# EAGLE design Arduinoboy (EAGLE 7.6.0)
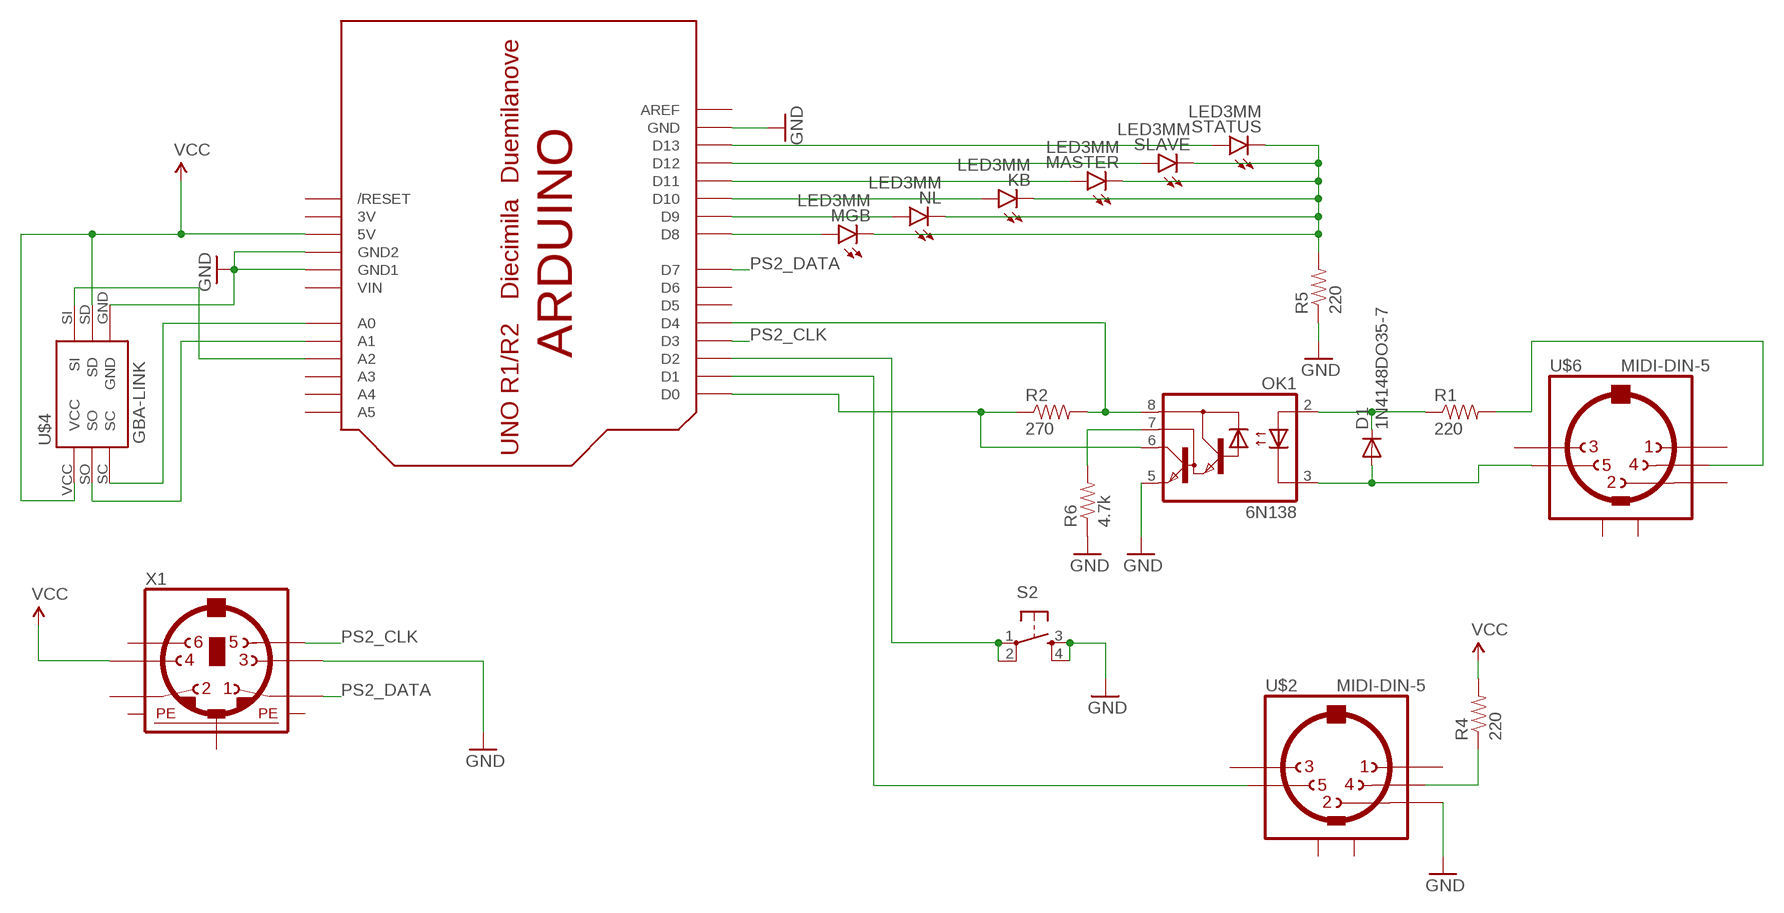
[diagram p0: schematic, sheet 1]

## Parts
D1  1N4148DO35-7  [DO35-7]
KB  LED3MM  [LED3MM]
MASTER  LED3MM  [LED3MM]
MGB  LED3MM  [LED3MM]
NL  LED3MM  [LED3MM]
OK1  6N138  [DIL08]
R1  220  RESISTORAXIAL-0.3  [AXIAL-0.3]
R2  270  RESISTORAXIAL-0.3  [AXIAL-0.3]
R4  220  RESISTORAXIAL-0.3  [AXIAL-0.3]
R5  220  RESISTORAXIAL-0.3  [AXIAL-0.3]
R6  4.7k  RESISTORAXIAL-0.3  [AXIAL-0.3]
S2  TAC_SWITCHPTH  [TACTILE-PTH]
SLAVE  LED3MM  [LED3MM]
STATUS  LED3MM  [LED3MM]
U$2  MIDI-DIN-5  [MIDI-DIN-5]
U$3  ARDUINOUNO  [ARDUINO]
U$4  GBA-LINK  [GBA-LINK]
U$6  MIDI-DIN-5  [MIDI-DIN-5]
X1  MINI_DIN_6  [M_DIN6]

## Nets
GND: OK1.5(GND) R5.P$1 R6.P$1 S2.3 S2.4 U$2.2 U$3.GND U$3.GND1 U$3.GND2 U$4.GND X1.3
N$1: D1.C OK1.2(A) R1.P$1
N$2: D1.A OK1.3(C) U$6.5
N$5: R4.P$1 U$2.4
N$6: MGB.A U$3.D8
N$7: U$2.5 U$3.D1
N$8: NL.A U$3.D9
N$9: OK1.8(VCC) R2.P$2 U$3.D4
N$10: OK1.6(VO) R2.P$1 U$3.D0
N$11: KB.A U$3.D10
N$12: MASTER.A U$3.D11
N$13: SLAVE.A U$3.D12
N$14: STATUS.A U$3.D13
N$15: KB.K(C) MASTER.K(C) MGB.K(C) NL.K(C) R5.P$2 SLAVE.K(C) STATUS.K(C)
N$16: OK1.7(VB) R6.P$2
N$17: U$3.A0 U$4.SC
N$19: R1.P$2 U$6.4
N$20: S2.1 S2.2 U$3.D2
N$21: U$3.A1 U$4.SO
N$22: U$3.A2 U$4.SI
PS2_CLK: U$3.D3 X1.5
PS2_DATA: U$3.D7 X1.1
VCC: R4.P$2 U$3.5V U$4.SD U$4.VCC X1.4
Unconnected: U$2.1 U$2.3 U$2.PE1 U$2.PE2 U$2.PE11(PE1) U$2.PE22(PE2) U$3.A3 U$3.A4 U$3.A5 U$3.AREF U$3.D5 U$3.D6 U$3.RESET(/RESET) U$4.S$1 U$4.S$2(S$1) U$6.1 U$6.2 U$6.3 U$6.PE1 U$6.PE2 U$6.PE11(PE1) U$6.PE22(PE2) X1.2 X1.6

## Power pins joined to a net without a drawn wire
3V: U$3.3V
PE1: X1.SH1(PE1)
PE2: X1.SH2(PE2)
PE3: X1.SH3(PE3)
VIN: U$3.VIN

## Library data of the parts
D1 = diode:1N4148: DIODE high speed (Philips)
KB MASTER MGB NL SLAVE STATUS = gm-diodes:LED
OK1 = optocoupler:6N138: MOTOROLA OPTO COUPLER
R1 R2 R4-R6 = SparkFun-Resistors:RESISTOR: Resistor Basic schematic elements and footprints for 0603, 1206, and PTH resistors.
S2 = SparkFun-Retired:TAC_SWITCH: Momentary Switch Button commonly used for reset or general input. Spark Fun Electronics SKU : COM-00097 SMT- SWCH-08247
U$2 U$6 = MIDI by Jazz:MIDI-DIN-5
U$3 = adafruit_modif:ARDUINO: Arduino Diecimila/Duemilanove Make a shield with ease, this package has all the named pins as well as the two mounting drill holes and an outline of the USB and DC power connector. The outline is on the DIMENSION layer, so if your board house uses it they will cut the outline to match. http://www.ladyada.net/library/pcb/eaglelibrary.html
U$4 = Catskulls_link_port:GBA-LINK
X1 = mini_din:MINI_DIN_6

## Board
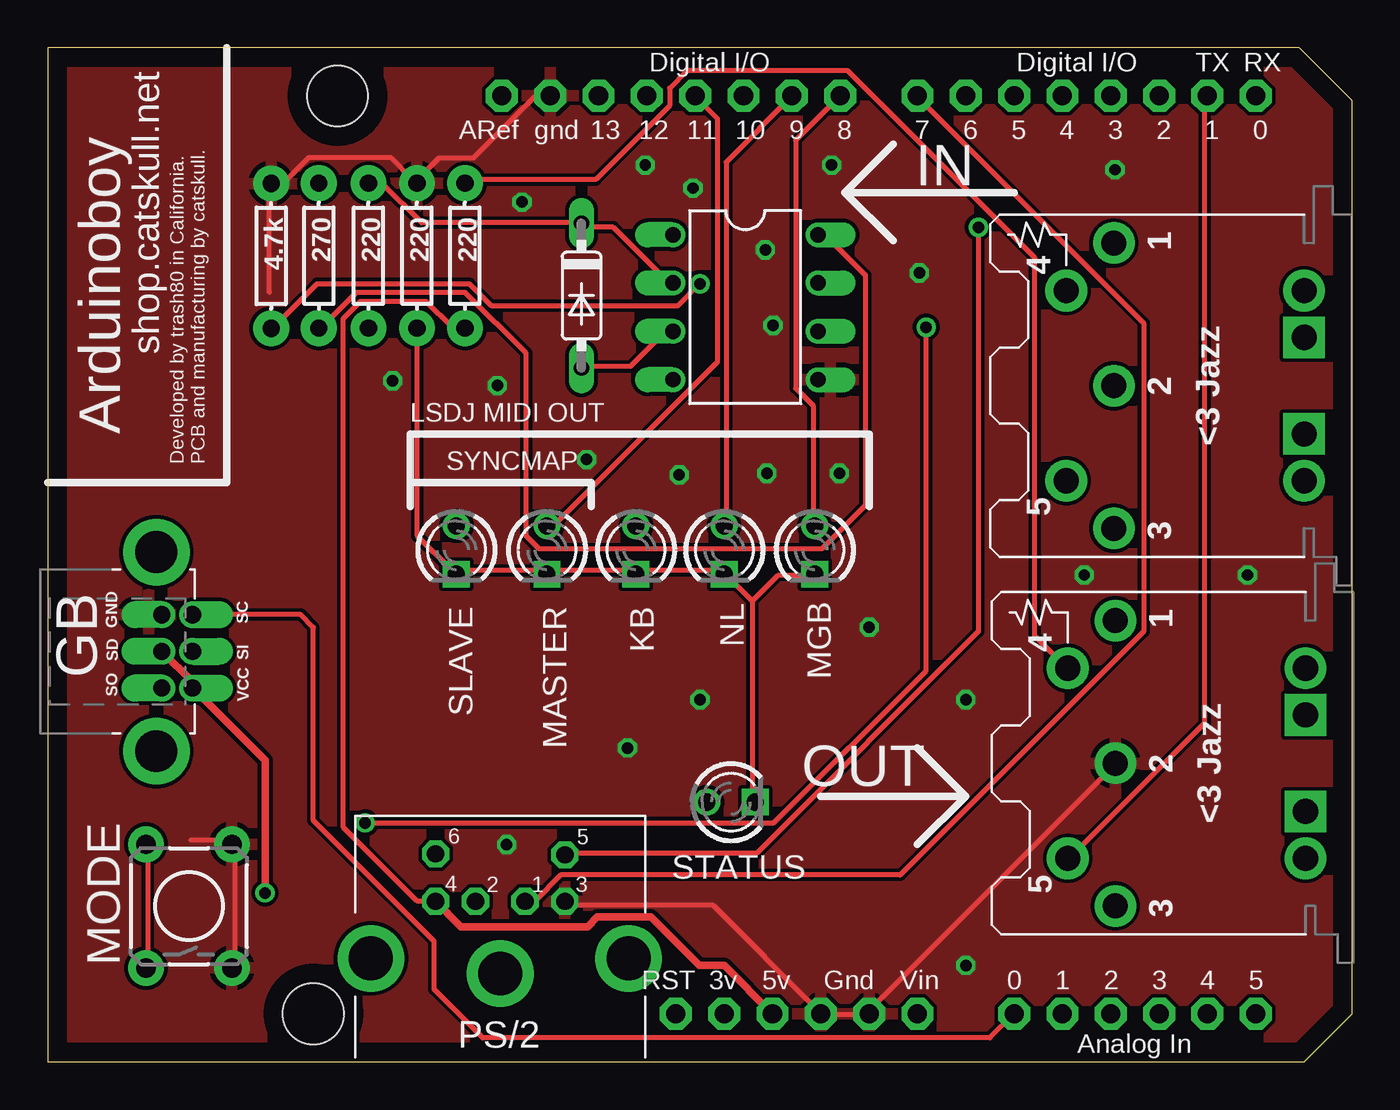
[diagram p1: board, top side]
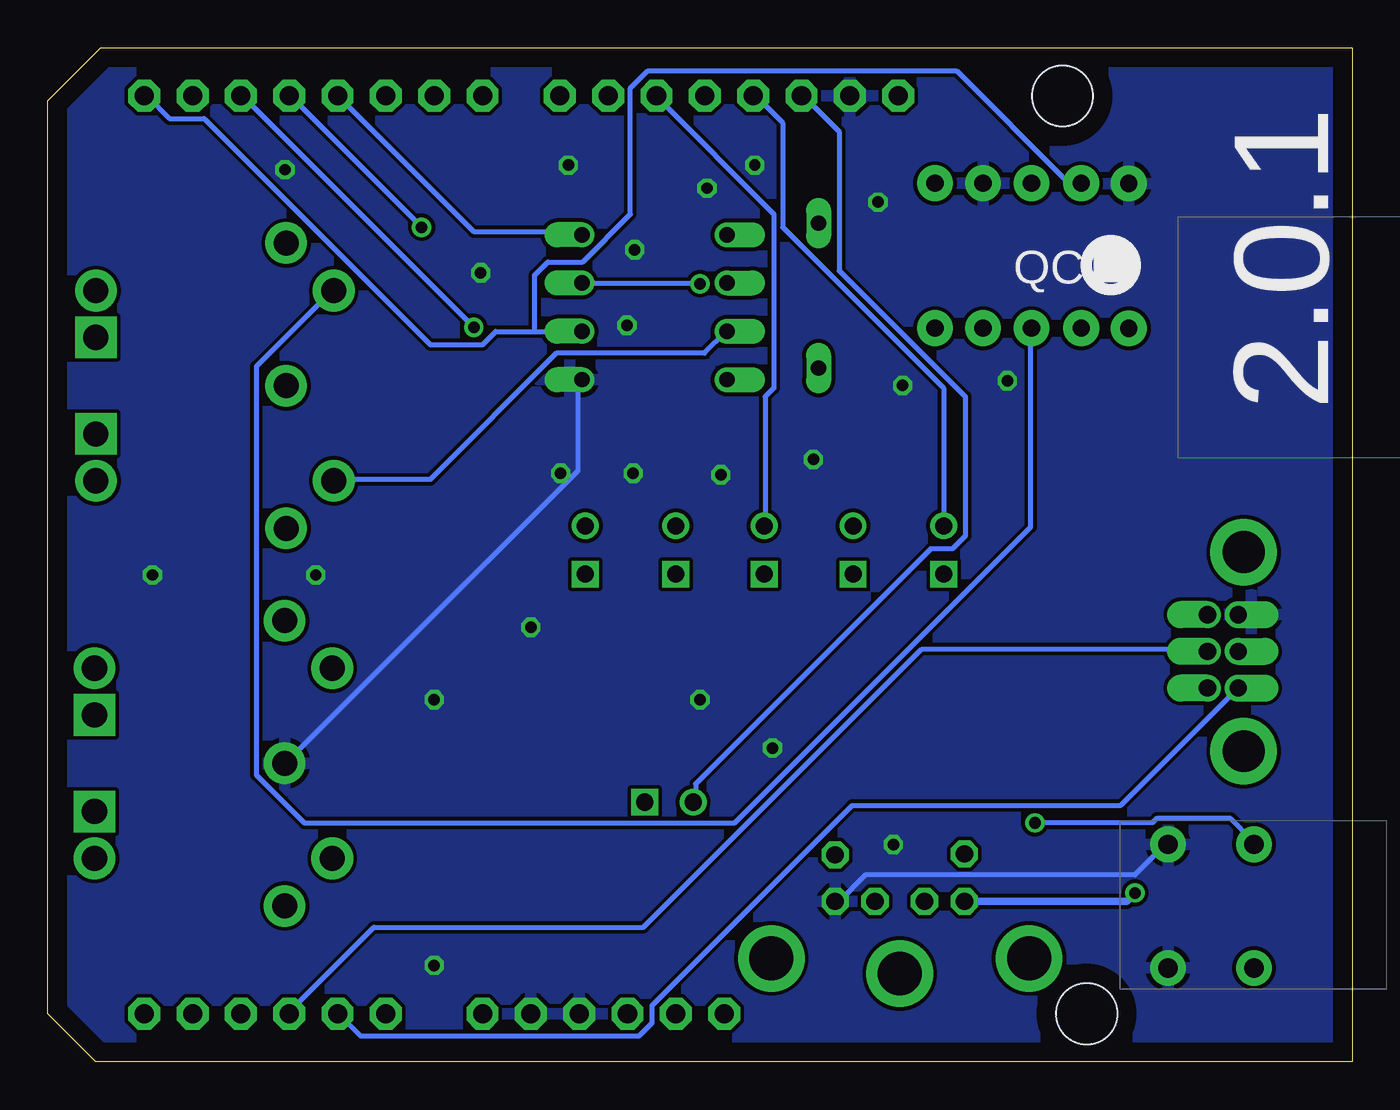
[diagram p2: board, bottom side, seen from below]

Size 68.58 x 53.34 mm. Coordinates in mm from the lower left corner, seen from the top.
Copper layers (1*16): Top 0.035mm / dielectric 1.5mm / Bottom 0.035mm
Design rules "default *": minimum track width 10mil, minimum drill 24mil, track to track 8mil, track to pad 8mil, pad to pad 8mil, via to via 8mil, smd to smd 8mil, copper to edge 40mil, drill to drill 8mil, minimum pad ring 10mil, minimum via ring 8mil, stop-mask expansion 4mil, vias tented up to drill 25mil, thermal gap 10mil

### Footprints (pad centres in the part's own frame; a part is rotated, then mirrored left to right if it is on the bottom)
DO35-7 = drill 0.813 long: A 3.81,0; C -3.81,0
LED3MM = drill 0.9: A -1.27,0 | drill 0.9 square: K 1.27,0
DIL08 = drill 0.813 offset: 1 -3.81,-3.81; 2 -1.27,-3.81; 3 1.27,-3.81; 4 3.81,-3.81; 5 3.81,3.81; 6 1.27,3.81; 7 -1.27,3.81; 8 -3.81,3.81
AXIAL-0.3 = drill 0.9 pad 1.88: P$1 -3.81,0; P$2 3.81,0
TACTILE-PTH = drill 1.016 pad 1.88: 1 -3.251,2.261; 2 3.251,2.261; 3 -3.251,-2.261; 4 3.251,-2.261
MIDI-DIN-5 = drill 1.321 pad 2.184: 1 -7.5,-10; 2 0,-10; 3 7.5,-10; 4 -5,-12.5; 5 5,-12.5; PE1 5,0; PE2 -5,0 | drill 1.321 pad 2.184 square: PE11 2.54,0; PE22 -2.54,0
ARDUINO = drill 1 pad 1.676 octagon: 3V 35.56,2.54; 5V 38.1,2.54; A0 50.8,2.54; A1 53.34,2.54; A2 55.88,2.54; A3 58.42,2.54; A4 60.96,2.54; A5 63.5,2.54; AREF 23.876,50.8; D0 63.5,50.8; D1 60.96,50.8; D2 58.42,50.8; D3 55.88,50.8; D4 53.34,50.8; D5 50.8,50.8; D6 48.26,50.8; D7 45.72,50.8; D8 41.656,50.8; D9 39.116,50.8; D10 36.576,50.8; D11 34.036,50.8; D12 31.496,50.8; D13 28.956,50.8; GND 26.416,50.8; GND1 43.18,2.54; GND2 40.64,2.54; RESET 33.02,2.54; VIN 45.72,2.54 | hole 3.2: 15.24,50.8; 13.97,2.54
GBA-LINK = drill 0.9 pad 1.27 offset: GND -1.93,-1.61; SC -1.93,0; SD 0,-1.61; SI 0,0; SO 1.93,-1.61; VCC 1.93,0 | drill 2.2 pad 3.5: S$1 -5.22,-1.905; S$2 5.25,-1.905
M_DIN6 = drill 0.9 pad 1.422 octagon: 1 -1.3,-3.75; 2 1.3,-3.75; 3 -3.4,-3.75; 4 3.4,-3.75; 5 -3.4,-6.2; 6 3.4,-6.25 | drill 2.3 pad 3.5: SH1 6.8,-0.75; SH2 0,0.05; SH3 -6.75,-0.75

### Placement (x,y rotation side)
D1  28.06,40.3 270 top
KB  30.92,26.92 270 top
MASTER  26.24,26.92 270 top
MGB  40.32,26.92 270 top
NL  35.56,26.92 270 top
OK1  36.67,39.69 270 top
R1  16.87,42.39 270 top
R2  14.25,42.39 270 top
R4  21.94,42.39 270 top
R5  19.41,42.39 270 top
R6  11.75,42.38 270 top
S2  7.43,8.19 90 top
SLAVE  21.48,26.92 270 top
STATUS  35.92,13.67 0 top
U$2  66.12,15.71 270 top
U$3  0,0 0 top
U$4  7.62,21.59 270 top
U$6  66.04,35.56 270 top
X1  23.79,4.7 180 top

### Tracks (layer width: path | path; a pad name or v marks a point on that pad's centre or on a via)
GND  (via drill 0.6)
  Top 0.254: X1.3 27.2,8.23 34.98,8.23 40.46,2.74 U$3.GND2 40.69,2.52 42.98,2.52 U$3.GND1 43.2,2.74 56.01,15.54 U$2.2 | U$3.GND 26.29,50.75 25.6,50.75 22.4,47.55 20.57,47.55 19.43,46.41 R5.P$1 19.2,46.41 18.06,47.55 13.72,47.55 12.57,46.41 11.89,46.41 R6.P$1 11.66,46.18 11.66,40.46 | 7.54,11.66 9.6,11.66 S2.4 9.83,11.43 9.83,5.03 S2.3
  Bottom 0.254: OK1.5 40.69,35.66 40.69,31.09 56.01,15.77 U$2.2 | X1.3 26.98,8.46 25.6,9.83 11.43,9.83 9.83,11.43 S2.4
  other vias: 43.18,22.86 34.29,19.05 37.81,30.95 33.19,30.87 54.48,25.61 63.07,25.61 48.26,19.05 48.26,5.08 30.48,16.51 23.64,35.57 38.13,38.73 37.73,42.7 28.33,31.68 24.13,11.43 18.13,35.82 33.92,45.95 45.82,41.49 56.1,46.92 41.21,47.16 24.93,45.22 31.41,47.16 41.61,30.95
  pour Bottom: 0,0 0,53.34 66.04,53.34 68.58,50.8 68.58,2.54 66.04,0
  pour Top: 0,53.34 66.04,53.34 68.58,50.8 68.58,2.54 66.04,0 0,0
N$1
  Top 0.254: OK1.2 32.69,40.92 29.72,43.89 28.12,43.89 D1.C 27.89,44.12 19.66,44.12 17.6,46.18 16.92,46.18 R1.P$1
N$2
  Top 0.254: D1.A 28.12,36.58 30.63,36.58 32.69,38.63 OK1.3
  Bottom 0.254: U$6.5 53.49,30.63 48.46,30.63 41.83,37.26 34.06,37.26 32.92,38.41 OK1.3
N$5
  Top 0.254: R4.P$1 21.95,46.41 28.8,46.41 32.69,50.29 32.69,51.21 33.6,52.12 42.06,52.12 51.89,42.29 51.89,22.4 53.49,20.8 U$2.4
N$6
  Top 0.254: U$3.D8 39.32,48.46 39.32,35.43 40.23,34.52 40.23,28.35 MGB.A
N$7
  Top 0.254: U$3.D1 60.81,50.75 60.81,17.83 53.72,10.74 U$2.5
N$8
  Top 0.254: NL.A 35.66,28.35 35.66,47.32 39.09,50.75 U$3.D9
N$9
  Top 0.254: R2.P$2 14.4,38.63 16.23,40.46 21.95,40.46 25.15,37.26 25.15,27.66 25.83,26.98 40.69,26.98 42.98,29.26 42.98,41.38 40.69,43.66 OK1.8
  Bottom 0.254: OK1.8 40.69,43.66 46.18,43.66 53.26,50.75 U$3.D4
N$10
  Bottom 0.254: 42.98,38.41 45.03,38.41 45.72,37.72 48.46,37.72 60.35,49.61 62.18,49.61 63.32,50.75 U$3.D0 | 42.98,38.41 40.69,38.41 OK1.6 | 42.98,38.41 42.98,41.38 42.29,42.06 40.46,42.06 37.95,44.58 37.95,51.21 37.03,52.12 20.8,52.12 15.09,46.41 14.4,46.41 R2.P$1
N$11
  Bottom 0.254: KB.A 30.86,28.35 30.86,34.98 30.4,35.43 30.4,44.58 36.58,50.75 U$3.D10
N$12
  Top 0.254: MASTER.A 26.29,28.35 26.75,28.35 35.2,36.8 35.2,49.61 34.06,50.75 U$3.D11
N$13
  Bottom 0.254: SLAVE.A 21.49,28.35 21.49,35.43 29.95,43.89 29.95,49.38 31.32,50.75 U$3.D12
N$14
  Bottom 0.254: STATUS.A 34.52,13.72 34.52,14.63 22.17,26.98 21.03,26.98 20.34,27.66 20.34,34.98 26.98,41.6 26.98,48.92 28.8,50.75 U$3.D13
N$15
  Top 0.254: R5.P$2 19.43,38.41 19.43,27.66 21.26,25.83 SLAVE.K 21.49,25.83 26.06,25.83 MASTER.K 26.29,25.83 30.86,25.83 KB.K 31.09,25.83 35.43,25.83 NL.K 35.66,25.6 37.03,24.23 | 37.03,24.23 37.03,13.72 STATUS.K | 37.03,24.23 38.41,25.6 40.23,25.6 MGB.K
N$16  (via drill 0.61)
  Top 0.254: v34.29,40.92 33.15,39.78 23.32,39.78 22.17,40.92 14.17,40.92 11.89,38.63 R6.P$2
  Bottom 0.254: v34.29,40.92 40.46,40.92 OK1.7
N$17
  Top 0.254: U$4.SC 13.31,23.52 13.97,22.86 13.97,12.7 20.32,6.35 20.32,3.81 22.86,1.27 49.53,1.27 U$3.A0
N$19
  Bottom 0.254: R1.P$2 16.92,38.41 16.92,28.12 32.46,12.57 55.09,12.57 57.61,15.09 57.61,36.58 53.72,40.46 U$6.4
N$20  (via drill 0.61)
  Top 0.254: v46.18,38.63 46.18,20.57 38.18,12.57 v16.69,12.57 | S2.1 5.26,5.03 5.26,11.43 S2.2
  Bottom 0.254: v46.18,38.63 58.29,50.75 U$3.D2 | v16.69,12.57 10.52,12.57 10.29,12.8 6.4,12.8 5.26,11.66 S2.2
N$21
  Bottom 0.254: U$3.A1 53.26,2.52 52.12,1.37 37.49,1.37 36.8,2.06 36.8,2.97 26.29,13.49 12.18,13.49 U$4.SO
N$22
  Bottom 0.254: U$3.A2 55.78,2.74 51.44,7.09 37.26,7.09 22.63,21.72 7.62,21.72 U$4.SI
PS2_CLK  (via drill 0.61)
  Top 0.254: v48.92,43.89 48.92,22.63 37.26,10.97 27.2,10.97 X1.5
  Bottom 0.254: v48.92,43.89 55.78,50.75 U$3.D3
PS2_DATA
  Top 0.254: X1.1 25.15,8.46 25.6,8.46 26.98,9.83 44.81,9.83 57.61,22.63 57.61,38.86 45.72,50.75 U$3.D7
VCC  (via drill 0.6)
  Top 0.254: R4.P$2 21.72,38.63 21.26,38.63 19.89,40.01 16.46,40.01 15.54,39.09 15.54,12.34 19.43,8.46 20.34,8.46 X1.4
  Top 0.406: U$4.SD 7.62,19.98 U$4.VCC 11.43,15.85 v11.43,8.89 | X1.4 21.72,7.12 28.39,7.12 28.9,7.62 31.71,7.62 34.25,5.08 35.56,5.08 U$3.5V
  Bottom 0.406: v11.43,8.89 11.87,8.45 X1.4

### Text on the board
tNames: shop.catskull.net | TX | RX | IN | LSDJ MIDI OUT | Arduinoboy | Developed by trash80 in California. / PCB and manufacturing by catskull. | SYNCMAP | GB | OUT | MODE | PS/2
bNames: QC | 2.0.1